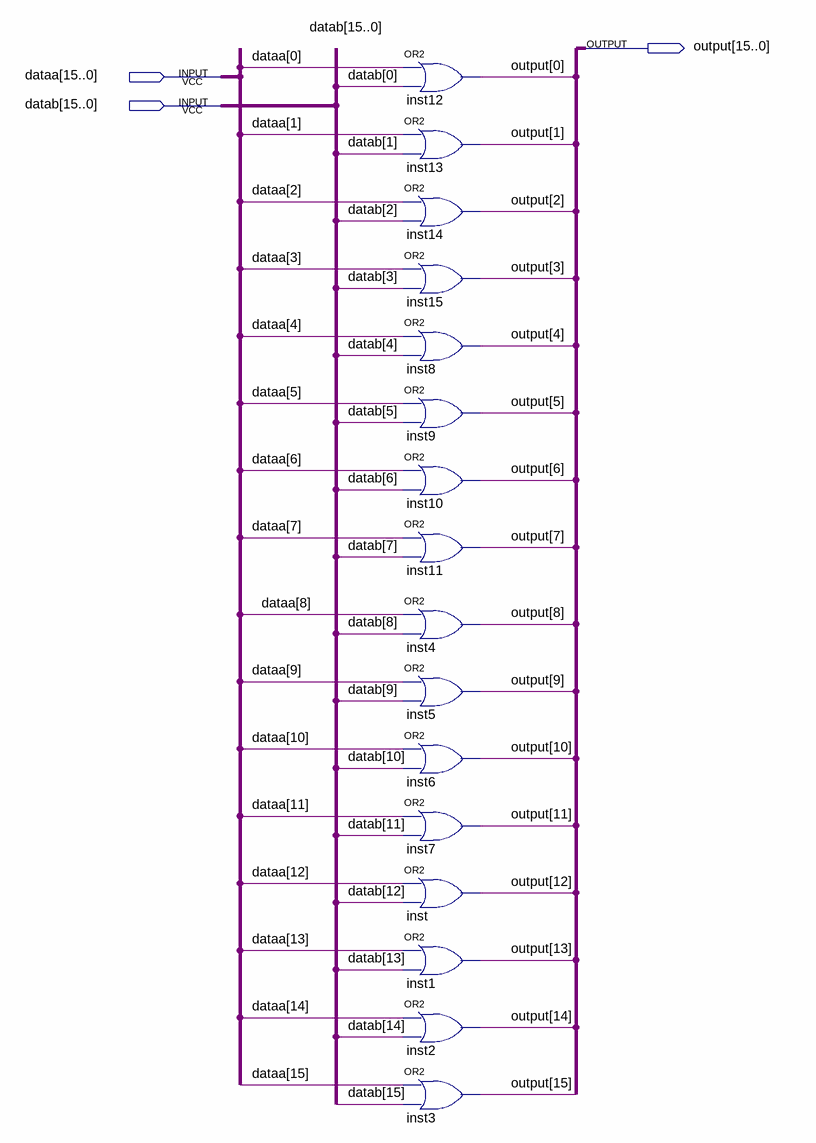
[diagram p0: schematic sheet]
// Quartus schematic Alu_Or.bdf as structural Verilog: 16 symbols, 3 pins
module Alu_Or (
  input  [15:0] dataa,
  input  [15:0] datab,
  output [15:0] \output 
);

  or inst12 (\output [0], dataa[0], datab[0]);
  or inst13 (\output [1], dataa[1], datab[1]);
  or inst14 (\output [2], dataa[2], datab[2]);
  or inst15 (\output [3], dataa[3], datab[3]);
  or inst8 (\output [4], dataa[4], datab[4]);
  or inst9 (\output [5], dataa[5], datab[5]);
  or inst10 (\output [6], dataa[6], datab[6]);
  or inst11 (\output [7], dataa[7], datab[7]);
  or inst4 (\output [8], dataa[8], datab[8]);
  or inst5 (\output [9], dataa[9], datab[9]);
  or inst6 (\output [10], dataa[10], datab[10]);
  or inst7 (\output [11], dataa[11], datab[11]);
  or inst (\output [12], dataa[12], datab[12]);
  or inst1 (\output [13], dataa[13], datab[13]);
  or inst2 (\output [14], dataa[14], datab[14]);
  or inst3 (\output [15], dataa[15], datab[15]);
endmodule
